# EasyEDA Pro project ProProject_hsr_pass_lite_2024-01-15.epro, schematic sch_hsr_pass_lite_v1p1
Create Date: 2024-01-02; Page Name: P1; Project Name: hsr_pass_lite_v1p1; Schematic Name: sch_hsr_pass_lite_v1p1; Update Date: 2024-01-10; Company: 嘉立创EDA; Page Size: A4; Version: V1.0
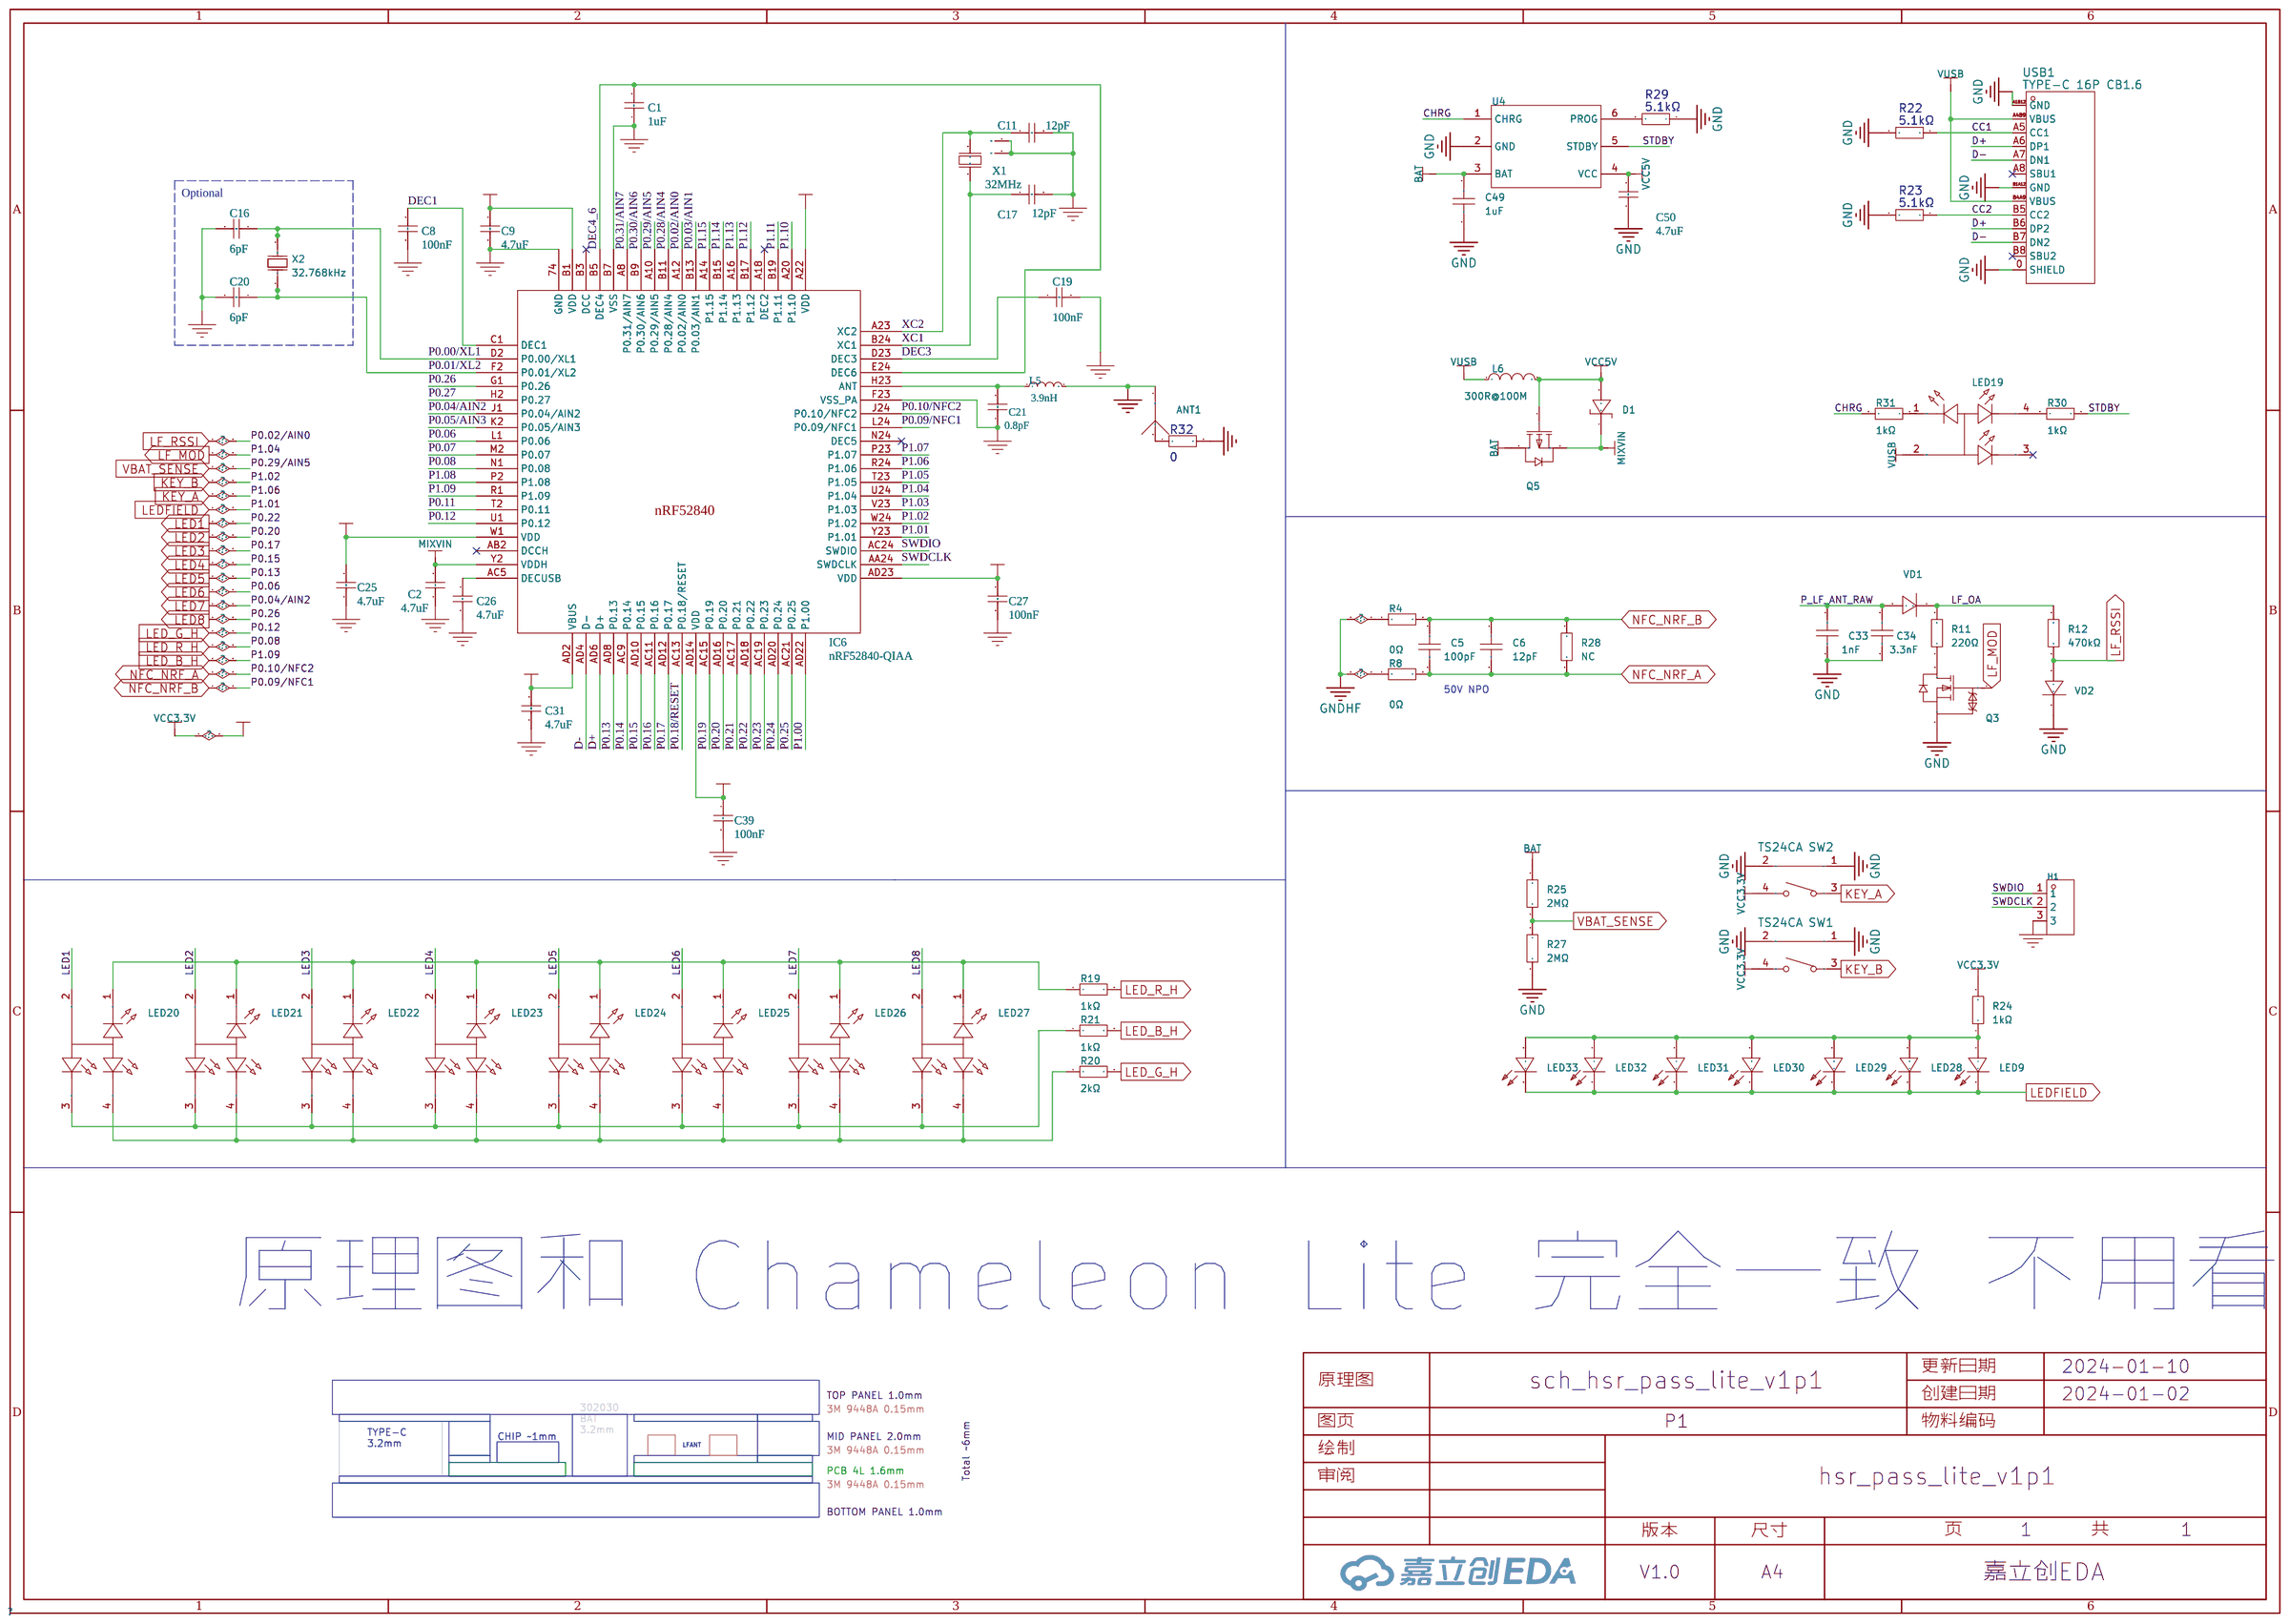
[diagram p0: schematic sheet]

## Parts
ANT1  CA-C01  [ANT-SMD_L3.2-W1.6_CA-C01]
C1  1uF  [c0402]
C2  4.7uF  [c0402]
C5  100pF  [c0402]
C6  12pF  [c0402]
C8  100nF  [c0402]
C9  4.7uF  [c0402]
C11  12pF  [c0402]
C16  6pF  [c0402]
C17  12pF  [c0402]
C19  100nF  [c0402]
C20  6pF  [c0402]
C21  0.8pF  [c0402]
C25  4.7uF  [c0402]
C26  4.7uF  [c0402]
C27  100nF  [c0402]
C31  4.7uF  [c0402]
C33  1nF  [c0402]
C34  3.3nF  [c0402]
C39  100nF  [c0402]
C49  1uF  [c0402]
C50  4.7uF  [c0402]
D1  1N5819WS  [SOD-323_L1.8-W1.3-LS2.5-RD]
H1  PZ254V-11-03P  [HDR-TH_3P-P2.54-V-M]
IC6  nRF52840-QIAA  [aqfn50p700x700x85_hs-74n]
L5  3.9nH  [l0402]
L6  300R@100M  [l0603]
LED9  NCD0402W1  [LED0402-R-RD]
LED19  XL-1615RGBC-RF  [LED-ARRAY-SMD_4P-L1.6-W1.5-BR_XL-1615RGBC-RF]
LED20  XL-1615RGBC-RF  [LED-ARRAY-SMD_4P-L1.6-W1.5-BR_XL-1615RGBC-RF]
LED21  XL-1615RGBC-RF  [LED-ARRAY-SMD_4P-L1.6-W1.5-BR_XL-1615RGBC-RF]
LED22  XL-1615RGBC-RF  [LED-ARRAY-SMD_4P-L1.6-W1.5-BR_XL-1615RGBC-RF]
LED23  XL-1615RGBC-RF  [LED-ARRAY-SMD_4P-L1.6-W1.5-BR_XL-1615RGBC-RF]
LED24  XL-1615RGBC-RF  [LED-ARRAY-SMD_4P-L1.6-W1.5-BR_XL-1615RGBC-RF]
LED25  XL-1615RGBC-RF  [LED-ARRAY-SMD_4P-L1.6-W1.5-BR_XL-1615RGBC-RF]
LED26  XL-1615RGBC-RF  [LED-ARRAY-SMD_4P-L1.6-W1.5-BR_XL-1615RGBC-RF]
LED27  XL-1615RGBC-RF  [LED-ARRAY-SMD_4P-L1.6-W1.5-BR_XL-1615RGBC-RF]
LED28  NCD0402W1  [LED0402-R-RD]
LED29  NCD0402W1  [LED0402-R-RD]
LED30  NCD0402W1  [LED0402-R-RD]
LED31  NCD0402W1  [LED0402-R-RD]
LED32  NCD0402W1  [LED0402-R-RD]
LED33  NCD0402W1  [LED0402-R-RD]
Q3  -  [SOT-723_L1.2-W0.8-P0.40-LS1.2-BR]
Q5  AO3401A  [SOT-23_L2.9-W1.3-P1.90-LS2.4-BR]
R4  0Ω  [R0402]
R8  0Ω  [R0402]
R11  220Ω  [r0402]
R12  470kΩ  [r0402]
R19  1kΩ  [r0402]
R20  2kΩ  [r0402]
R21  1kΩ  [r0402]
R22  5.1kΩ  [r0402]
R23  5.1kΩ  [r0402]
R24  1kΩ  [r0402]
R25  2MΩ  [r0402]
R27  2MΩ  [r0402]
R28  NC  [R0402]
R29  5.1kΩ  [r0402]
R30  1kΩ  [r0402]
R31  1kΩ  [r0402]
R32  0  [r0402]
SW1  TS24CA  [SW-SMD_TS24CA]
SW2  TS24CA  [SW-SMD_TS24CA]
U4  TP4057-42-SOT26-R  [SOT-23-6_L2.9-W1.6-P0.95-LS2.8-BL]
USB1  TYPE-C 16P CB1.6  [USB-C-SMD_TYPE-C-16P-CB0.8-FIX]
VD1  -  [SOD-523_L1.2-W0.8-LS1.6-RD]
VD2  -  [SOD-523_L1.2-W0.8-LS1.6-RD]
X1  32MHz  [bt-xtal_2016]
X2  32.768kHz  [CRYSTAL-SMD_L1.7-W1.1]

## Library data of the parts
ANT1 = CA-C01: Supplier Part: C9900018999; Supplier Footprint: SMD_3.2x1.6x0.4mm; JLCPCB Part Class: ExtendedPart; Datasheet: https://atta.szlcsc.comnull; Supplier: LCSC
C1 = GRM155R61E105KA12D: 容值:1uF;精度:±10%;额定电压:25V;材质(温度系数):X5R;; LCSC Part Name: 1uF±10%25V; Supplier Part: C77009; Manufacturer: muRata(村田); Supplier Footprint: 0402; JLCPCB Part Class: ExtendedPart; Datasheet: https://atta.szlcsc.com/upload/public/pdf/source/20180326/C77009_C84F63FC30571BAC77C5C818267378FE.pdf; Supplier: LCSC; Tolerance: ±10%; Voltage Rated: 25V; Temperature Coefficient: X5R; Design Item ID: C0603-1µ0; Library Name: AltiumLib; Part Number: C0603-1µ0; LatestRevisionDate: 2013-06-05; Pad Count: 2; Published: 2009-05-08; Footprint Doc: 0603
C2 C25 C26 = CL05A475MP5NRNC: 容值:4.7uF;精度:±20%;额定电压:10V;材质(温度系数):X5R;; LCSC Part Name: 4.7uF±20%10V; Supplier Part: C23733; Manufacturer: SAMSUNG(三星); Supplier Footprint: 0402; JLCPCB Part Class: BasicPart; Datasheet: https://atta.szlcsc.com/upload/public/pdf/source/20160103/1457707710457.pdf; Supplier: LCSC; Tolerance: ±20%; Voltage Rated: 10V; Temperature Coefficient: X5R; Design Item ID: C0603-4µ7-6.3V-X7R; Library Name: AltiumLib; Part Number: C0603-4µ7-6.3V-X7R; LatestRevisionDate: 2015-06-10; Pad Count: 2; Published: 2015-06-10; Footprint Doc: 0603
C5 = 0402CG101J500NT: 容值:100pF;精度:±5%;额定电压:50V;材质(温度系数):C0G;; LCSC Part Name: 100pF ±5% 50V; Supplier Part: C1546; Manufacturer: FH(风华); Supplier Footprint: 0402; JLCPCB Part Class: Basic Part; Datasheet: https://atta.szlcsc.com/upload/public/pdf/source/20200305/C486355_26A10D38EF8C2A5C37091D0039909270.pdf; Supplier: LCSC; Tolerance: ±5%; Voltage Rated: 50V; Temperature Coefficient: C0G
C6 = 0402CG120J500NT: 容值:12pF;精度:±5%;额定电压:50V;材质(温度系数):C0G;; LCSC Part Name: 12pF ±5% 50V; Supplier Part: C1547; Manufacturer: FH(风华); Supplier Footprint: 0402; JLCPCB Part Class: Basic Part; Datasheet: https://atta.szlcsc.com/upload/public/pdf/source/20200305/C486355_26A10D38EF8C2A5C37091D0039909270.pdf; Supplier: LCSC; Tolerance: ±5%; Voltage Rated: 50V; Temperature Coefficient: C0G
C8 C27 C39 = CL05B104KO5NNNC: 容值:100nF;精度:±10%;额定电压:16V;材质(温度系数):X7R;; LCSC Part Name: 100nF±10%16V; Supplier Part: C1525; Manufacturer: SAMSUNG(三星); Supplier Footprint: 0402; JLCPCB Part Class: BasicPart; Datasheet: https://atta.szlcsc.com/upload/public/pdf/source/20160103/1457707674891.pdf; Supplier: LCSC; Tolerance: ±10%; Voltage Rated: 16V; Temperature Coefficient: X7R; Design Item ID: C0402-100n; Library Name: AltiumLib; Part Number: C0402-100n; LatestRevisionDate: 2009-11-23; Pad Count: 2; Published: 2009-05-08; Footprint Doc: 0402
C9 = CL05A475MP5NRNC: 容值:4.7uF;精度:±20%;额定电压:10V;材质(温度系数):X5R;; LCSC Part Name: 4.7uF±20%10V; Supplier Part: C23733; Manufacturer: SAMSUNG(三星); Supplier Footprint: 0402; JLCPCB Part Class: BasicPart; Datasheet: https://atta.szlcsc.com/upload/public/pdf/source/20160103/1457707710457.pdf; Supplier: LCSC; Tolerance: ±20%; Voltage Rated: 10V; Temperature Coefficient: X5R; Design Item ID: C0603-1µ0; Library Name: AltiumLib; Part Number: C0603-1µ0; LatestRevisionDate: 2013-06-05; Pad Count: 2; Published: 2009-05-08; Footprint Doc: 0603
C11 C17 = GCM1555C1H120FA16D: 容值:12pF;精度:±1%;额定电压:50V;材质(温度系数):C0G;; LCSC Part Name: 12pF±1%50V; Supplier Part: C393682; Manufacturer: muRata(村田); Supplier Footprint: 0402; JLCPCB Part Class: ExtendedPart; Datasheet: https://atta.szlcsc.com/upload/public/pdf/source/20190516/C393682_2405B7553F1D74F0F214F12B2CF6E34B.pdf; Supplier: LCSC; Tolerance: ±1%; Voltage Rated: 50V; Temperature Coefficient: C0G; Design Item ID: C0402-12p; Library Name: AltiumLib; Part Number: C0402-12p; LatestRevisionDate: 2011-05-11; Pad Count: 2; Published: 2009-05-08; Footprint Doc: 0402
C16 C20 = GCM1555C1H6R0BA16D: 容值:6pF;额定电压:50V;材质(温度系数):C0G;; LCSC Part Name: 6pF50V±0.1pF; Supplier Part: C437443; Manufacturer: muRata(村田); Supplier Footprint: 0402; JLCPCB Part Class: ExtendedPart; Datasheet: https://atta.szlcsc.com/upload/public/pdf/source/20191016/C437443_6494D7E8B750F866266038D048782478.pdf; Supplier: LCSC; Voltage Rated: 50V; Temperature Coefficient: C0G; Design Item ID: C0402-12p; Library Name: AltiumLib; Part Number: C0402-12p; LatestRevisionDate: 2011-05-11; Pad Count: 2; Published: 2009-05-08; Footprint Doc: 0402
C19 = CL05B104KO5NNNC: 容值:100nF;精度:±10%;额定电压:16V;材质(温度系数):X7R;; LCSC Part Name: 100nF±10%16V; Supplier Part: C1525; Manufacturer: SAMSUNG(三星); Supplier Footprint: 0402; JLCPCB Part Class: BasicPart; Datasheet: https://atta.szlcsc.com/upload/public/pdf/source/20160103/1457707674891.pdf; Supplier: LCSC; Tolerance: ±10%; Voltage Rated: 16V; Temperature Coefficient: X7R; Design Item ID: C0402-100p; Library Name: AltiumLib; Part Number: C0402-100p; LatestRevisionDate: 2009-05-08; Pad Count: 2; Published: 2009-05-08; Footprint Doc: 0402
C21 = GJM1555C1HR80WB01D: 容值:0.8pF;额定电压:50V;材质(温度系数):C0G;; LCSC Part Name: 0.8pF50V; Supplier Part: C88902; Manufacturer: muRata(村田); Supplier Footprint: 0402; JLCPCB Part Class: ExtendedPart; Datasheet: https://atta.szlcsc.com/upload/public/pdf/source/20161125/1480067958619.pdf; Supplier: LCSC; Voltage Rated: 50V; Temperature Coefficient: C0G; Part Number: C0402-0.8p; LatestRevisionDate: 2012-11-21; Pin Count: 2; Publisher: Nordic Semiconductor; Published: 2009-05-08; Note: 50V; Footprint Doc: 0402
C31 C50 = CL05A475MP5NRNC: 容值:4.7uF;精度:±20%;额定电压:10V;材质(温度系数):X5R;; LCSC Part Name: 4.7uF±20%10V; Supplier Part: C23733; Manufacturer: SAMSUNG(三星); Supplier Footprint: 0402; JLCPCB Part Class: BasicPart; Datasheet: https://atta.szlcsc.com/upload/public/pdf/source/20160103/1457707710457.pdf; Supplier: LCSC; Tolerance: ±20%; Voltage Rated: 10V; Temperature Coefficient: X5R; Design Item ID: C0603-4µ7-10V-X7S; Library Name: AltiumLib; Part Number: C0603-4µ7-10V-X7S; LatestRevisionDate: 2016-08-15; Pad Count: 2; Published: 2016-08-15; Footprint Doc: 0603
C33 = GRM1555C1H102JA01D: 容值:1nF;精度:±5%;额定电压:50V;材质(温度系数):C0G;; LCSC Part Name: 1nF±5%50V; Supplier Part: C76947; Manufacturer: muRata(村田); Supplier Footprint: 0402; JLCPCB Part Class: ExtendedPart; Datasheet: https://atta.szlcsc.com/upload/public/pdf/source/20180307/C76947_15204091165631407735.pdf; Supplier: LCSC; Tolerance: ±5%; Voltage Rated: 50V; Temperature Coefficient: C0G; Standardization Check: false
C34 = GRM1555C1H332JE01D: 容值:3.3nF;精度:±5%;额定电压:50V;材质(温度系数):C0G;; LCSC Part Name: 3.3nF±5%50V; Supplier Part: C1518207; Manufacturer: muRata(村田); Supplier Footprint: 0402; JLCPCB Part Class: ExtendedPart; Datasheet: https://atta.szlcsc.com/upload/public/pdf/source/20210531/FD6681253CF7037B02F87719489FDB3E.pdf; Supplier: LCSC; Tolerance: ±5%; Voltage Rated: 50V; Temperature Coefficient: C0G
C49 = GRM155R61E105KA12D: 容值:1uF;精度:±10%;额定电压:25V;材质(温度系数):X5R;; LCSC Part Name: 1uF±10%25V; Supplier Part: C77009; Manufacturer: muRata(村田); Supplier Footprint: 0402; JLCPCB Part Class: ExtendedPart; Datasheet: https://atta.szlcsc.com/upload/public/pdf/source/20180326/C77009_C84F63FC30571BAC77C5C818267378FE.pdf; Supplier: LCSC; Tolerance: ±10%; Voltage Rated: 25V; Temperature Coefficient: X5R
D1 = 1N5819WS_C191023: 直流反向耐压(Vr):40V;平均整流电流(Io):1A;正向压降(Vf):600mV@1A;; LCSC Part Name: 40V 1A 600mV@1A; Supplier Part: C191023; Manufacturer: Hottech(合科泰); Supplier Footprint: SOD-323; JLCPCB Part Class: 基础库; Datasheet: https://atta.szlcsc.com/upload/public/pdf/source/20220428/3CB86FD8D28D653594B4E35F9D5AEFD9.pdf; Supplier: LCSC; Reverse Voltage (Vr): 40V; Average Rectified Current (Io): 1A; Forward Voltage (Vf@If): 600mV@1A
H1 = PZ254V-11-03P: 排数:单排;总PIN位数:3;间距:2.54mm;插针结构:1x3P;行距:-;安装类型:直插;圆针/方针:方针;额定电流:3A;额定电压:250V;配合针长度:6mm;塑高:2.5mm;端接针长度:3mm;工作温度范围:-40℃~+105℃;颜色:黑色;; LCSC Part Name: 2.54mm 1x3P 直插 方针; Supplier Part: C2937625; Manufacturer: XFCN(兴飞); Supplier Footprint: 直插,P=2.54mm; JLCPCB Part Class: 扩展库; Datasheet: 2022-07-12/581362A/62b9d00620994b3696be7eb4af85ad72/双排排针和单排排针.pdf; Supplier: LCSC; Number of Rows: 单排; Number of Pins: 3; Pitch: 2.54mm; Pin Structure: 1x3P; Mounting Type: 直插; Circluar Pins/Square Pins: 方针; Current Rating (Max): 3A; Voltage Rating (Max): 250V; Length of Mating Pin: 6mm; Insulation Height: 2.5mm; Length of End Connection Pin: 3mm; Operating Temperature Range: -40℃~+105℃; Color: 黑色
IC6 = NRF52840-QIAA-R: Multi-protocol Bluetooth Low Energy, IEEE 802.15.4, ANT and 2.4GHz proprietary system-on-chip; LCSC Part Name: 蓝牙，IEEE802.15.4-2006，2.4GHz收发器; Supplier Part: C190794; Manufacturer: NORDIC; Supplier Footprint: AQFN-73-EP(7x7); JLCPCB Part Class: ExtendedPart; Datasheet: https://atta.szlcsc.com/upload/public/pdf/source/20200927/C190794_1756B5489BD6AA72AA26FA1BF8B48337.pdf; Supplier: LCSC; Library Name: AltiumLib; LatestRevisionDate: 2017-08-21; Published: 2017-08-21; Footprint Doc: AQFN-73; Pad Count: 73
L5 = LQG15HH3N9B02D: 电感值:3.9nH;精度:±0.1nH;额定电流:-;饱和电流(Isat):-;直流电阻(DCR):140mΩ;; LCSC Part Name: 3.9nH±0.1nH140mΩ; Supplier Part: C907911; Manufacturer: muRata(村田); Supplier Footprint: 0402; JLCPCB Part Class: ExtendedPart; Datasheet: https://atta.szlcsc.com/upload/public/pdf/source/20201022/C907911_457CACF7CE408B204DFE599731ED13A0.pdf; Supplier: LCSC; Tolerance: ±0.1nH; DC Resistance (DCR): 140mΩ; Q @ Freq: 8@100MHz; Frequency - Self Resonant: 6GHz
L6 = CBW160808U301T: 标称阻抗@测试频率:300Ω@100MHz;误差:±25%;直流电阻(RDC):300mΩ;; LCSC Part Name: 单路0603磁珠阻抗300Ω@100MHz; Supplier Part: C139179; Manufacturer: FH(风华); Supplier Footprint: 0603; JLCPCB Part Class: ExtendedPart; Datasheet: https://atta.szlcsc.com/upload/public/pdf/source/20171102/C139179_15096094167331078760.pdf; Supplier: LCSC; Impedance @ Frequency: 300Ω@100MHz; Tolerance: ±25%; DC Resistance: 300mΩ; Current Rating: 1A; Circuits: 1
LED9 LED28-LED33 = NCD0402W1: 发光颜色:白灯;; LCSC Part Name: 白灯; Supplier Part: C130725; Manufacturer: 国星光电; Supplier Footprint: 0402; JLCPCB Part Class: ExtendedPart; Datasheet: https://atta.szlcsc.com/upload/public/pdf/source/20200820/C130725_E8B8126ADB11FE759337C6C5B57FD0C8.pdf; Supplier: LCSC; Emitted Color: 白灯
LED19-LED27 = XL-1615RGBC-RF: 发光颜色:RGB三色;二极管配置:-;主波长:468nm；620nm~625nm；515nm;色温:-;功率:80mW；80mW；55mW;安装方式:正贴;; LCSC Part Name: 正贴; Supplier Part: C965840; Manufacturer: XINGLIGHT(成兴光); Supplier Footprint: 0606; JLCPCB Part Class: 扩展库; Datasheet: https://atta.szlcsc.com/upload/public/pdf/source/20221102/F1B1FC7E45BA82C0C0D2B0679BEE9200.pdf; Supplier: LCSC; Emitted Color: RGB三色; Lens Color: 无色透明; Dominant Wavelength: 468nm；620nm~625nm；515nm; Peak Wavelength: 520nm；625nm；473nm; Forward Current: 25mA; Power Dissipation: 80mW；80mW；55mW; Viewing Angle: 120°; Mounting Sytle: 正贴; Operating Temperature: -30℃~+85℃
Q3 = 2N7002EM3T5G: 类型:N沟道;漏源电压(Vdss):60V;连续漏极电流(Id):350mA;功率(Pd):150mW;导通电阻(RDS(on)@Vgs,Id):1.5Ω4.5V,200mA;阈值电压(Vgs(th)@Id):1.85V250uA;栅极电荷(Qg@Vgs):-;输入电容(Ciss@Vds):42pF10V;反向传输电容(Crss@Vds):-;工作温度(最小值):-;工作温度(最大值):+150℃(Tj);; Supplier Part: C907843; Manufacturer: TECHPUBLIC(台舟); Supplier Footprint: SOT-723; JLCPCB Part Class: ExtendedPart; Datasheet: https://atta.szlcsc.com/upload/public/pdf/source/20210825/866ACA059DC199D201FD0DE780C59844.pdf; Supplier: LCSC; Type: N沟道; Drain Source Voltage (Vdss): 60V; Continuous Drain Current (Id): 350mA; Power Dissipation (Pd): 150mW; Drain Source On Resistance (RDS(on)@Vgs,Id): 1.5Ω4.5V,200mA; Gate Threshold Voltage (Vgs(th)@Id): 1.85V250uA; Input Capacitance (Ciss@Vds): 42pF10V; Operating Temperature (Max): +150℃(Tj)
Q5 = AO3401A_C15127: 类型:P沟道;漏源电压(Vdss):30V;连续漏极电流(Id):4A;功率(Pd):1.4W;导通电阻(RDS(on)@Vgs,Id):44mΩ@10V,4.3A;; LCSC Part Name: P沟道 30V 4A; Supplier Part: C15127; Manufacturer: AOS; Supplier Footprint: SOT-23-3L; JLCPCB Part Class: 基础库; Datasheet: https://atta.szlcsc.com/upload/public/pdf/source/20160507/1462613609053.pdf; Supplier: LCSC; Type: P沟道; Drain Source Voltage (Vdss): 30V; Continuous Drain Current (Id): 4A; Power Dissipation (Pd): 1.4W; Drain Source On Resistance (RDS(on)@Vgs,Id): 44mΩ@10V,4.3A; Gate Threshold Voltage (Vgs(th)@Id): 1.3V@250uA
R4 R8 R28 = 0402WGF0000TCE: 电阻类型:厚膜电阻;阻值:0Ω;精度:±1%;功率:62.5mW;; LCSC Part Name: 0Ω ±1% 62.5mW; Supplier Part: C17168; Manufacturer: UNI-ROYAL(厚声); Supplier Footprint: 0402; JLCPCB Part Class: 基础库; Datasheet: https://atta.szlcsc.com/upload/public/pdf/source/20200306/C422600_1E6D84923E4A46A82E41ADD87F860B5C.pdf; Supplier: LCSC; Type: 厚膜电阻; Tolerance: ±1%; Power(Watts): 62.5mW; Temperature Coefficient: ±800ppm/℃; Overload Voltage (Max): 50V; Operating Temperature Range: -55℃~+155℃
R11 = 0402WGF2200TCE: 电阻类型:厚膜电阻;阻值:220Ω;精度:±1%;功率:62.5mW;; LCSC Part Name: 220Ω±1%62.5mW; Supplier Part: C25091; Manufacturer: UNI-ROYAL(厚声); Supplier Footprint: 0402; JLCPCB Part Class: BasicPart; Datasheet: https://atta.szlcsc.com/upload/public/pdf/source/20200306/C422600_1E6D84923E4A46A82E41ADD87F860B5C.pdf; Supplier: LCSC; Type: 厚膜电阻; Tolerance: ±1%; Power(Watts): 62.5mW; Temperature Coefficient: ±100ppm/℃; Overload Voltage (Max): 50V; Operating Temperature Range: -55℃~+155℃
R12 = 0402WGF4703TCE: 电阻类型:厚膜电阻;阻值:470kΩ;精度:±1%;功率:62.5mW;; LCSC Part Name: 470kΩ±1%62.5mW; Supplier Part: C25790; Manufacturer: UNI-ROYAL(厚声); Supplier Footprint: 0402; JLCPCB Part Class: BasicPart; Datasheet: https://atta.szlcsc.com/upload/public/pdf/source/20200306/C422600_1E6D84923E4A46A82E41ADD87F860B5C.pdf; Supplier: LCSC; Type: 厚膜电阻; Tolerance: ±1%; Power(Watts): 62.5mW; Temperature Coefficient: ±100ppm/℃; Overload Voltage (Max): 50V; Operating Temperature Range: -55℃~+155℃
R19 R21 R24 R30 R31 = 0402WGF1001TCE: 电阻类型:厚膜电阻;阻值:1kΩ;精度:±1%;功率:62.5mW;; LCSC Part Name: 1kΩ±1%62.5mW; Supplier Part: C11702; Manufacturer: UNI-ROYAL(厚声); Supplier Footprint: 0402; JLCPCB Part Class: BasicPart; Datasheet: https://atta.szlcsc.com/upload/public/pdf/source/20200306/C422600_1E6D84923E4A46A82E41ADD87F860B5C.pdf; Supplier: LCSC; Type: 厚膜电阻; Tolerance: ±1%; Power(Watts): 62.5mW; Temperature Coefficient: ±100ppm/℃; Overload Voltage (Max): 50V; Operating Temperature Range: -55℃~+155℃
R20 = 0402WGF2001TCE: 电阻类型:厚膜电阻;阻值:2kΩ;精度:±1%;功率:62.5mW;; LCSC Part Name: 2kΩ±1%62.5mW; Supplier Part: C4109; Manufacturer: UNI-ROYAL(厚声); Supplier Footprint: 0402; JLCPCB Part Class: BasicPart; Datasheet: https://atta.szlcsc.com/upload/public/pdf/source/20200306/C422600_1E6D84923E4A46A82E41ADD87F860B5C.pdf; Supplier: LCSC; Type: 厚膜电阻; Tolerance: ±1%; Power(Watts): 62.5mW; Temperature Coefficient: ±100ppm/℃; Overload Voltage (Max): 50V; Operating Temperature Range: -55℃~+155℃
R22 R23 R29 R32 = 0402WGF5101TCE: 电阻类型:厚膜电阻;阻值:5.1kΩ;精度:±1%;功率:62.5mW;; LCSC Part Name: 5.1kΩ±1%62.5mW; Supplier Part: C25905; Manufacturer: UNI-ROYAL(厚声); Supplier Footprint: 0402; JLCPCB Part Class: BasicPart; Datasheet: https://atta.szlcsc.com/upload/public/pdf/source/20200306/C422600_1E6D84923E4A46A82E41ADD87F860B5C.pdf; Supplier: LCSC; Type: 厚膜电阻; Tolerance: ±1%; Power(Watts): 62.5mW; Temperature Coefficient: ±100ppm/℃; Overload Voltage (Max): 50V; Operating Temperature Range: -55℃~+155℃
R25 R27 = ERJ2GEJ205X: 电阻类型:厚膜电阻;阻值:2MΩ;精度:±5%;功率:100mW;; LCSC Part Name: 2MΩ±5%100mW; Supplier Part: C413034; Manufacturer: PANASONIC(松下); Supplier Footprint: 0402; JLCPCB Part Class: ExtendedPart; Datasheet: https://atta.szlcsc.com/upload/public/pdf/source/20190820/C413034_7F2144D30B45D3EECCAD38244F1EE464.pdf; Supplier: LCSC; Type: 厚膜电阻; Tolerance: ±5%; Power(Watts): 100mW; Temperature Coefficient: -400ppm/℃~+150ppm/℃; Operating Temperature Range: -55℃~+155℃
SW1 SW2 = TS24CA: Supplier: LCSC; Supplier Part: C393942; Manufacturer: SHOU HAN; JLCPCB Part Class: Extended Part
U4 = TP4057-42-SOT26-R: LCSC Part Name: TP4057 1%; Supplier Part: C12044; Manufacturer: TOPPOWER(南京拓微); Supplier Footprint: SOT-23-6; JLCPCB Part Class: 基础库; Datasheet: https://atta.szlcsc.com/upload/public/pdf/source/20140228/1457706997013.pdf; Supplier: LCSC
USB1 = TYPE-C 16P CB1.6: Supplier: LCSC; JLCPCB Part Class: Extended Part
VD1 VD2 = 1N4148WT_C511874: Switching,VR=75VVRM=100VTrr&lt;4nSSOD-523; LCSC Part Name: 1N4148WT; Supplier Part: C511874; Manufacturer: BORN(伯恩半导体); Manufacturer Part: 1N4148WT; Supplier Footprint: SOD-523; JLCPCB Part Class: ExtendedPart; Datasheet: https://atta.szlcsc.com/upload/public/pdf/source/20201214/C511874_A5B142D9AA47F1ECF304275C26BC805E.pdf; Supplier: LCSC
X1 = X201632MOB4SI: 晶振类型:贴片无源晶振;频率:32MHz;频率公差:±10ppm;频率稳定度:±20ppm;负载电容:12pF;工作温度:-40℃~+85℃;; LCSC Part Name: 32MHz±10ppm12pF; Supplier Part: C2682773; Manufacturer: YXC(扬兴晶振); Supplier Footprint: SMD2016-4P; JLCPCB Part Class: ExtendedPart; Datasheet: https://atta.szlcsc.com/upload/public/pdf/source/20210329/C108154_97241DDF47B5B71D7D93F8906D63DA2F.pdf; Supplier: LCSC; Crystal Type: 贴片无源晶振; Frequency Tolerance: ±10ppm; Frequency Stability: ±20ppm; Load Capacitance: 12pF; Operating Temperature: -40℃~+85℃; Design Item ID: XTAL_SMD2016_32MHz_8pF_General; Library Name: AltiumLib; Part Number: XTAL_SMD2016_32MHz_8pF_General; LatestRevisionDate: 2016-08-19; Pad Count: 4; Published: 2016-08-19; Footprint Doc: XTAL_2016
X2 = X1A000121000500: 频率:32.768kHz;频率公差:-;负载电容:12.5pF;; LCSC Part Name: 32.768kHz12.5pF; Supplier Part: C5154201; Manufacturer: EPSON(爱普生); Supplier Footprint: SMD,1.65x1.05mm; JLCPCB Part Class: ExtendedPart; Datasheet: https://atta.szlcsc.com/upload/public/pdf/source/20220902/8E45647E0861F7DDF8A395DB16B8FC1E.pdf; Supplier: LCSC; Load Capacitance: 12.5pF

## Nets
GND: ANT1.1(ANT) C1.1 C2.2 C8.2 C9.2 C11.2 C16.2 C17.2 C19.2 C20.2 C21.1 C25.2 C26.2 C27.2 C31.2 C33.1 C34.1 C39.2 C49.1 C50.2 H1.3 IC6.74(GND) IC6.B7(VSS) IC6.F23(VSS_PA) L5.2 Q3.2(S) R22.2 R23.2 R27.1 R29.1 R32.2 SW1.1 SW1.2 SW2.1 SW2.2 U4.2(GND) USB1.0(SHIELD) USB1.A1B12(GND) USB1.B1A12(GND) VD2.1(K) X1.2(GND) X1.4(GND)
GNDHF: R4.1 R8.1
VCC3.3V: C9.1 C25.1 C27.1 C39.1 IC6.A22(VDD) IC6.AD14(VDD) IC6.AD23(VDD) IC6.B1(VDD) IC6.W1(VDD) R24.2 SW1.4 SW2.4
VCC5V: C31.1 C50.1 D1.2(A) IC6.AD2(VBUS) L6.2 Q5.1(G) U4.4(VCC)
BAT: C49.2 Q5.3(D) R25.2 U4.3(BAT)
CC1: R22.1 USB1.A5(CC1)
CC2: R23.1 USB1.B5(CC2)
CHRG: R31.2 U4.1(CHRG)
D+: IC6.AD6(D+) USB1.A6(DP1) USB1.B6(DP2)
D-: IC6.AD4(D-) USB1.A7(DN1) USB1.B7(DN2)
DEC1: C8.1 IC6.C1(DEC1)
DEC3: C19.1 IC6.D23(DEC3)
DEC4_6: C1.2 IC6.B5(DEC4) IC6.E24(DEC6)
KEY_A: IC6.R24(P1.06) SW2.3
KEY_B: IC6.W24(P1.02) SW1.3
LED1: IC6.AD18(P0.22) LED20.2(COM+)
LED2: IC6.AD16(P0.20) LED21.2(COM+)
LED3: IC6.AD12(P0.17) LED22.2(COM+)
LED4: IC6.AD10(P0.15) LED23.2(COM+)
LED5: IC6.AD8(P0.13) LED24.2(COM+)
LED6: IC6.L1(P0.06) LED25.2(COM+)
LED7: IC6.J1(P0.04/AIN2) LED26.2(COM+)
LED8: IC6.G1(P0.26) LED27.2(COM+)
LED_B_H: IC6.R1(P1.09) R21.2
LED_G_H: IC6.U1(P0.12) R20.2
LED_R_H: IC6.N1(P0.08) R19.2
LEDFIELD: IC6.Y23(P1.01) LED9.2(K) LED28.2(K) LED29.2(K) LED30.2(K) LED31.2(K) LED32.2(K) LED33.2(K)
LF_MOD: IC6.U24(P1.04) Q3.1(G)
LF_OA: R11.2 R12.2 VD1.1(K)
LF_RSSI: IC6.A12(P0.02/AIN0) R12.1 VD2.2(A)
MIXVIN: C2.1 D1.1(C) IC6.Y2(VDDH) Q5.2(S)
NFC_NRF_A: C5.1 C6.2 IC6.J24(P0.10/NFC2) R8.2 R28.1
NFC_NRF_B: C5.2 C6.1 IC6.L24(P0.09/NFC1) R4.2 R28.2
P0.00/XL1: C16.1 IC6.D2(P0.00/XL1) X2.2(OSC2)
P0.01/XL2: C20.1 IC6.F2(P0.01/XL2) X2.1(OSC1)
P0.03/AIN1: IC6.B13(P0.03/AIN1)
P0.05/AIN3: IC6.K2(P0.05/AIN3)
P0.07: IC6.M2(P0.07)
P0.11: IC6.T2(P0.11)
P0.14: IC6.AC9(P0.14)
P0.16: IC6.AC11(P0.16)
P0.18/RESET: IC6.AC13(P0.18/RESET)
P0.19: IC6.AC15(P0.19)
P0.21: IC6.AC17(P0.21)
P0.23: IC6.AC19(P0.23)
P0.24: IC6.AD20(P0.24)
P0.25: IC6.AC21(P0.25)
P0.27: IC6.H2(P0.27)
P0.28/AIN4: IC6.B11(P0.28/AIN4)
P0.29/AIN5: IC6.A10(P0.29/AIN5) R25.1 R27.2
P0.30/AIN6: IC6.B9(P0.30/AIN6)
P0.31/AIN7: IC6.A8(P0.31/AIN7)
P1.00: IC6.AD22(P1.00)
P1.03: IC6.V23(P1.03)
P1.05: IC6.T23(P1.05)
P1.07: IC6.P23(P1.07)
P1.08: IC6.P2(P1.08)
P1.10: IC6.A20(P1.10)
P1.11: IC6.B19(P1.11)
P1.12: IC6.B17(P1.12)
P1.13: IC6.A16(P1.13)
P1.14: IC6.B15(P1.14)
P1.15: IC6.A14(P1.15)
P_LF_ANT_RAW: C33.2 C34.2 VD1.2(A)
STDBY: R30.1 U4.5(STDBY)
SWDCLK: H1.2 IC6.AA24(SWDCLK)
SWDIO: H1.1 IC6.AC24(SWDIO)
VUSB: L6.1 LED19.2(COM+) USB1.A4B9(VBUS) USB1.B4A9(VBUS)
XC1: C17.1 IC6.B24(XC1) X1.1(inp)
XC2: C11.1 IC6.A23(XC2) X1.3(out)
$1N8545: Q3.3(D) R11.1
$1N17137: C26.1 IC6.AC5(DECUSB)
$1N17146: C21.2 IC6.H23(ANT) L5.1
$1N18003: LED19.1(R-) R31.1
$1N18006: LED19.4(G-) R30.2
$1N18050: R29.2 U4.6(PROG)
$1N18926: LED20.1(R-) LED21.1(R-) LED22.1(R-) LED23.1(R-) LED24.1(R-) LED25.1(R-) LED26.1(R-) LED27.1(R-) R19.1
$1N19313: LED20.3(B-) LED21.3(B-) LED22.3(B-) LED23.3(B-) LED24.3(B-) LED25.3(B-) LED26.3(B-) LED27.3(B-) R21.1
$1N19333: LED20.4(G-) LED21.4(G-) LED22.4(G-) LED23.4(G-) LED24.4(G-) LED25.4(G-) LED26.4(G-) LED27.4(G-) R20.1
$1N21424: LED9.1(A) LED28.1(A) LED29.1(A) LED30.1(A) LED31.1(A) LED32.1(A) LED33.1(A) R24.1
$1N23414: ANT1.2 R32.1

Not connected (* = marked no-connect by the designer): IC6 A18(DEC2)* AB2(DCCH)* B3(DCC)* N24(DEC5)*; LED19 3(B-)*; USB1 A8(SBU1)* B8(SBU2)*

## Notes on the sheet
- Optional
- 50V NPO
- 原理图和 Chameleon Lite 完全一致 不用看
- TOP PANEL 1.0mm
- 3M 9448A 0.15mm
- CHIP ~1mm
- 302030
  BAT
  3.2mm
- MID PANEL 2.0mm
- TYPE-C
  3.2mm
- LFANT
- 3M 9448A 0.15mm
- Ferrite Sheet
- 3M 9448A 0.15mm
- PCB 4L 1.6mm
- Total ~6mm
- BOTTOM PANEL 1.0mm
